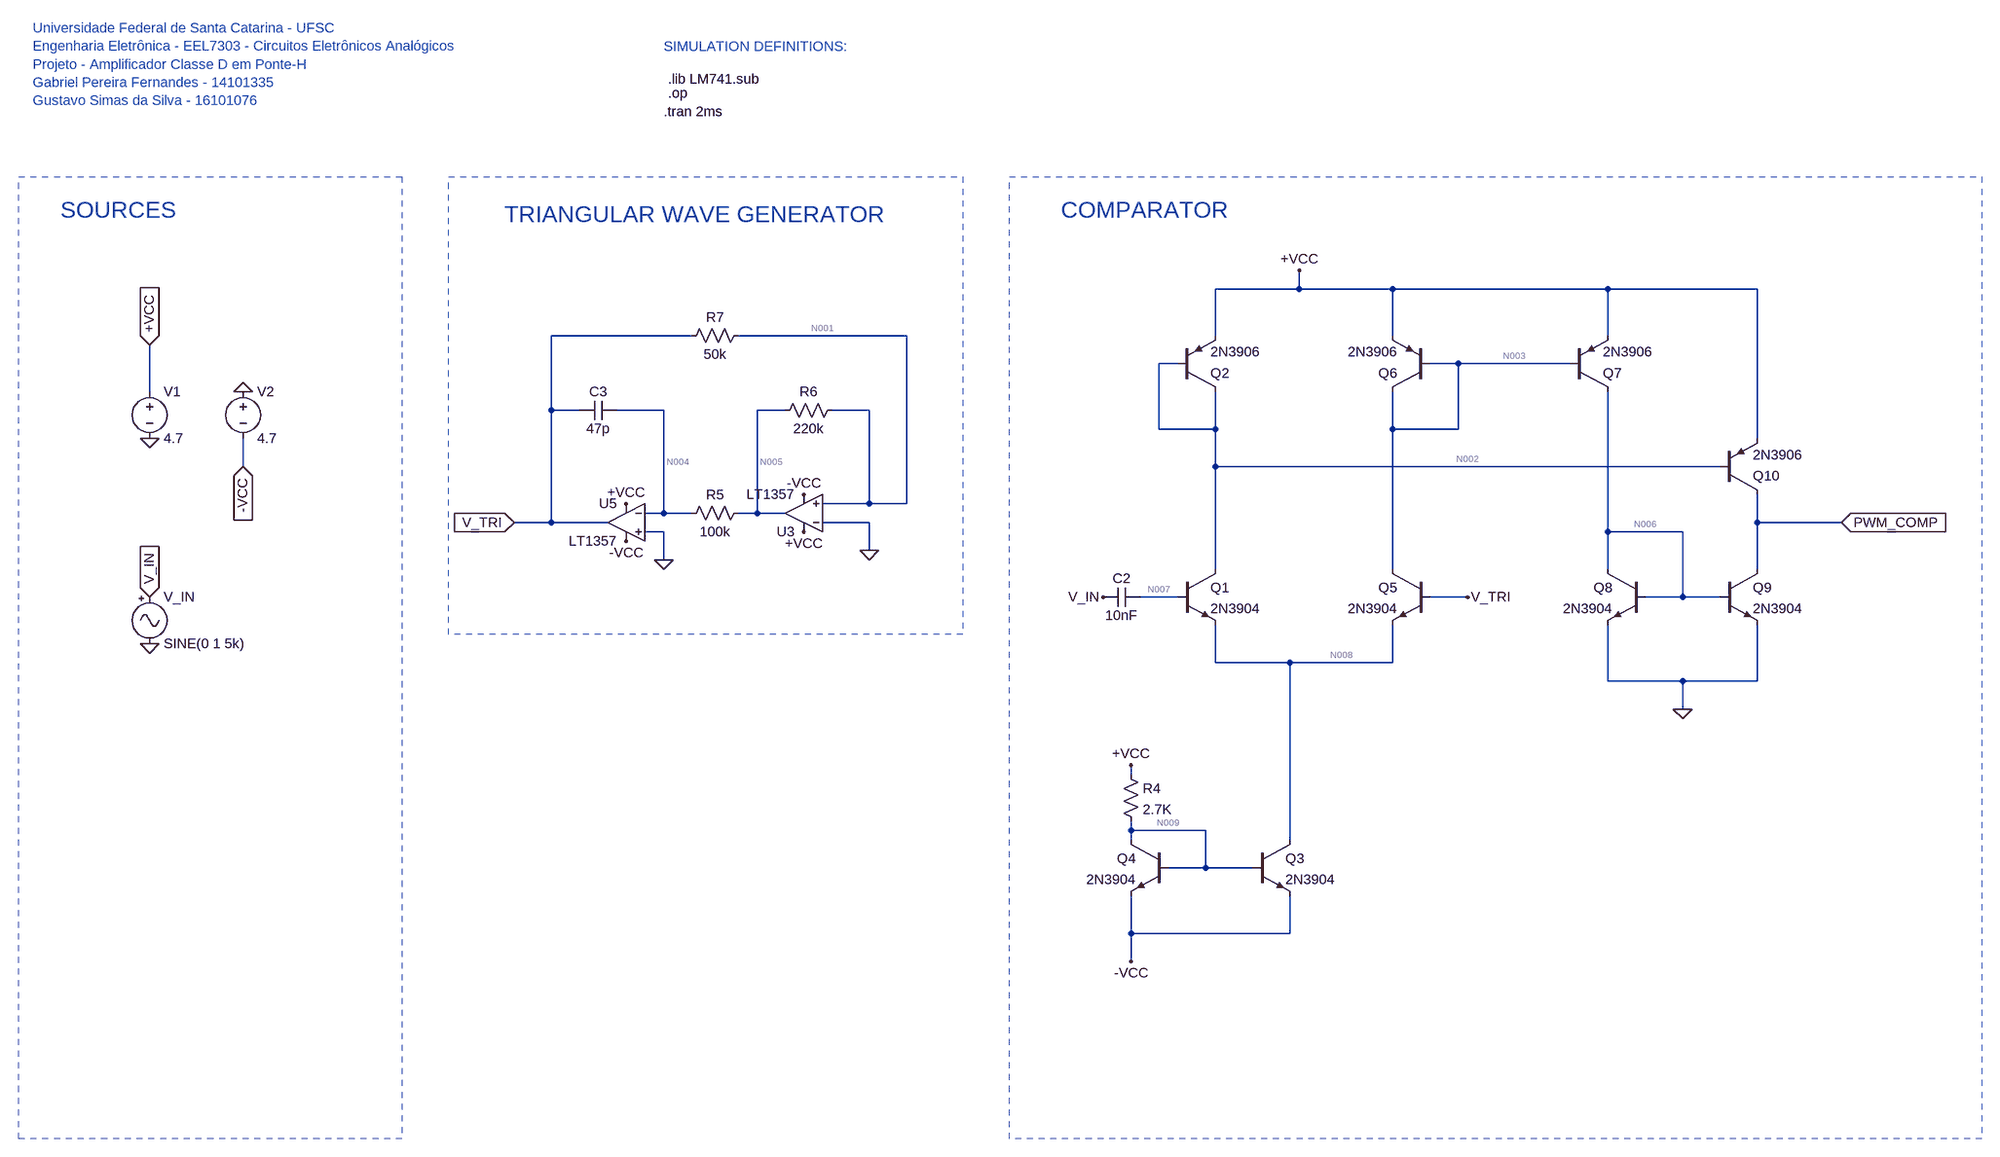
[diagram p0: schematic AmplificadorClasseD-V1.asc]
AmplificadorClasseD-V1.asc, the LTspice schematic file:
Version 4
SHEET 1 2448 932
WIRE 768 -528 768 -560
WIRE 768 -528 624 -528
WIRE 928 -528 768 -528
WIRE 1296 -528 928 -528
WIRE 1552 -528 1296 -528
WIRE -272 -448 -512 -448
WIRE 96 -448 -192 -448
WIRE 624 -448 624 -528
WIRE 928 -448 928 -528
WIRE 1296 -448 1296 -528
WIRE 560 -400 528 -400
WIRE 1040 -400 992 -400
WIRE 1232 -400 1040 -400
WIRE -1200 -352 -1200 -432
WIRE -512 -320 -512 -448
WIRE -464 -320 -512 -320
WIRE -320 -320 -400 -320
WIRE -112 -320 -160 -320
WIRE 32 -320 -32 -320
WIRE 528 -288 528 -400
WIRE 624 -288 624 -352
WIRE 624 -288 528 -288
WIRE 928 -288 928 -352
WIRE 1040 -288 1040 -400
WIRE 1040 -288 928 -288
WIRE 1552 -272 1552 -528
WIRE -1040 -224 -1040 -272
WIRE 624 -224 624 -288
WIRE 1488 -224 624 -224
WIRE 32 -160 32 -320
WIRE 32 -160 -48 -160
WIRE 96 -160 96 -448
WIRE 96 -160 32 -160
WIRE -320 -144 -320 -320
WIRE -320 -144 -352 -144
WIRE -272 -144 -320 -144
WIRE -160 -144 -160 -320
WIRE -160 -144 -192 -144
WIRE -112 -144 -160 -144
WIRE -512 -128 -512 -320
WIRE -512 -128 -576 -128
WIRE -416 -128 -512 -128
WIRE 32 -128 -48 -128
WIRE 1552 -128 1552 -176
WIRE 1696 -128 1552 -128
WIRE -320 -112 -352 -112
WIRE 1296 -112 1296 -352
WIRE 1424 -112 1296 -112
WIRE 32 -80 32 -128
WIRE -320 -64 -320 -112
WIRE 624 -48 624 -224
WIRE 928 -48 928 -288
WIRE 1296 -48 1296 -112
WIRE 1552 -48 1552 -128
WIRE 560 0 496 0
WIRE 1056 0 992 0
WIRE 1424 0 1424 -112
WIRE 1424 0 1360 0
WIRE 1488 0 1424 0
WIRE 624 112 624 48
WIRE 752 112 624 112
WIRE 928 112 928 48
WIRE 928 112 752 112
WIRE 1296 144 1296 48
WIRE 1424 144 1296 144
WIRE 1552 144 1552 48
WIRE 1552 144 1424 144
WIRE 1424 192 1424 144
WIRE 480 304 480 288
WIRE 480 400 480 384
WIRE 608 400 480 400
WIRE 480 416 480 400
WIRE 752 416 752 112
WIRE 608 464 608 400
WIRE 608 464 544 464
WIRE 688 464 608 464
WIRE 480 576 480 512
WIRE 752 576 752 512
WIRE 752 576 480 576
WIRE 480 624 480 576
FLAG -1200 -272 0
FLAG -1200 -432 +VCC
IOPIN -1200 -432 In
FLAG -1040 -352 0
FLAG -1040 -224 -VCC
IOPIN -1040 -224 In
FLAG -1200 80 0
FLAG -1200 0 V_IN
IOPIN -1200 0 In
FLAG 480 288 +VCC
FLAG 480 624 -VCC
FLAG 432 0 V_IN
FLAG 1056 0 V_TRI
FLAG 768 -560 +VCC
FLAG 1424 192 0
FLAG 1696 -128 PWM_COMP
IOPIN 1696 -128 In
FLAG -384 -160 +VCC
FLAG -384 -96 -VCC
FLAG -320 -64 0
FLAG -80 -112 +VCC
FLAG -80 -176 -VCC
FLAG 32 -80 0
FLAG -576 -128 V_TRI
IOPIN -576 -128 In
SYMBOL voltage -1200 -368 R0
WINDOW 123 0 0 Left 0
WINDOW 39 0 0 Left 0
SYMATTR InstName V1
SYMATTR Value 4.7
SYMBOL voltage -1040 -368 R0
WINDOW 123 0 0 Left 0
WINDOW 39 0 0 Left 0
SYMATTR InstName V2
SYMATTR Value 4.7
SYMBOL npn 560 -48 R0
SYMATTR InstName Q1
SYMATTR Value 2N3904
SYMBOL pnp 560 -352 M180
SYMATTR InstName Q2
SYMATTR Value 2N3906
SYMBOL Misc\\signal -1200 -16 R0
WINDOW 123 0 0 Left 0
WINDOW 39 0 0 Left 0
SYMATTR InstName V_IN
SYMATTR Value SINE(0 1 5k)
SYMBOL npn 688 416 R0
SYMATTR InstName Q3
SYMATTR Value 2N3904
SYMBOL npn 544 416 M0
SYMATTR InstName Q4
SYMATTR Value 2N3904
SYMBOL res 464 288 R0
SYMATTR InstName R4
SYMATTR Value 2.7K
SYMBOL npn 992 -48 M0
SYMATTR InstName Q5
SYMATTR Value 2N3904
SYMBOL pnp 992 -352 R180
SYMATTR InstName Q6
SYMATTR Value 2N3906
SYMBOL cap 496 -16 R90
WINDOW 0 0 32 VBottom 2
WINDOW 3 32 32 VTop 2
SYMATTR InstName C2
SYMATTR Value 10nF
SYMBOL pnp 1232 -352 M180
SYMATTR InstName Q7
SYMATTR Value 2N3906
SYMBOL npn 1360 -48 M0
SYMATTR InstName Q8
SYMATTR Value 2N3904
SYMBOL npn 1488 -48 R0
SYMATTR InstName Q9
SYMATTR Value 2N3904
SYMBOL pnp 1488 -176 M180
SYMATTR InstName Q10
SYMATTR Value 2N3906
SYMBOL Opamps\\LT1357 -384 -192 M0
SYMATTR InstName U5
SYMBOL res -176 -160 R90
WINDOW 0 0 56 VBottom 2
WINDOW 3 32 56 VTop 2
SYMATTR InstName R5
SYMATTR Value 100k
SYMBOL Opamps\\LT1357 -80 -80 R180
SYMATTR InstName U3
SYMBOL cap -400 -336 R90
WINDOW 0 0 32 VBottom 2
WINDOW 3 32 32 VTop 2
SYMATTR InstName C3
SYMATTR Value 47p
SYMBOL res -16 -336 R90
WINDOW 0 0 56 VBottom 2
WINDOW 3 32 56 VTop 2
SYMATTR InstName R6
SYMATTR Value 220k
SYMBOL res -176 -464 R90
WINDOW 0 0 56 VBottom 2
WINDOW 3 32 56 VTop 2
SYMATTR InstName R7
SYMATTR Value 50k
TEXT -320 -960 Left 2 !.tran 2ms
TEXT -312 -1016 Left 2 !.lib LM741.sub
TEXT -1400 -1104 Left 2 ;Universidade Federal de Santa Catarina - UFSC\nEngenharia Eletrônica - EEL7303 - Circuitos Eletrônicos Analógicos\nProjeto - Amplificador Classe D em Ponte-H\nGabriel Pereira Fernandes - 14101335\nGustavo Simas da Silva - 16101076
TEXT -320 -1072 Left 2 ;SIMULATION DEFINITIONS:
TEXT -312 -992 Left 2 !.op
TEXT -1352 -664 Left 4 ;SOURCES
TEXT -592 -656 Left 4 ;TRIANGULAR WAVE GENERATOR
TEXT 360 -664 Left 4 ;COMPARATOR
RECTANGLE Normal -768 928 -1424 -720 2
RECTANGLE Normal 192 64 -688 -720 2
RECTANGLE Normal 1936 928 272 -720 2

The netlist it stands for:
* AmplificadorClasseD-V1.asc
V1 +VCC 0 4.7
V2 0 -VCC 4.7
Q1 N002 N007 N008 0 2N3904
Q2 N002 N002 +VCC 0 2N3906
V_IN V_IN 0 SINE(0 1 5k)
Q3 N008 N009 -VCC 0 2N3904
Q4 N009 N009 -VCC 0 2N3904
R4 +VCC N009 2.7K
Q5 N003 V_TRI N008 0 2N3904
Q6 N003 N003 +VCC 0 2N3906
C2 N007 V_IN 10nF
Q7 N006 N003 +VCC 0 2N3906
Q8 N006 N006 0 0 2N3904
Q9 PWM_COMP N006 0 0 2N3904
Q10 PWM_COMP N002 +VCC 0 2N3906
XU5 0 N004 +VCC -VCC V_TRI LT1357  ; pins In+ In- V+ V- OUT
R5 N005 N004 100k
XU3 N001 0 +VCC -VCC N005 LT1357  ; pins In+ In- V+ V- OUT
C3 N004 V_TRI 47p
R6 N001 N005 220k
R7 N001 V_TRI 50k
.model NPN NPN
.model PNP PNP
.lib standard.bjt
.tran 2ms
.lib LM741.sub
* Universidade Federal de Santa Catarina - UFSC
* Engenharia Eletrônica - EEL7303 - Circuitos Eletrônicos Analógicos
* Projeto - Amplificador Classe D em Ponte-H
* Gabriel Pereira Fernandes - 14101335
* Gustavo Simas da Silva - 16101076
* SIMULATION DEFINITIONS:
.op
* SOURCES
* TRIANGULAR WAVE GENERATOR
* COMPARATOR
.backanno
.end

* Results of the author's LTspice run, read from the files saved beside the schematic
* Operating Point, zero values left out:
*   V(+vcc) = 4.7 V
*   V(-vcc) = -4.7 V
*   V(n002) = 4.393 V
*   V(n007) = -377 mV
*   V(n008) = -682.4 mV
*   V(n009) = -4.014 V
*   V(n003) = 4.013 V
*   V(v_tri) = 3.289 mV
*   V(n006) = 683.6 mV
*   V(pwm_comp) = 5.878 mV
*   V(n004) = -55.21 nV
*   V(n005) = 12.06 mV
*   V(n001) = 181.5 nV
*   Ic(Q10) = -1.465 nA
*   Ib(Q10) = -2.911 pA
*   Ie(Q10) = 1.468 nA
*   Ic(Q7) = -3.375 mA
*   Ib(Q7) = -16.47 µA
*   Ie(Q7) = 3.392 mA
*   Ic(Q6) = -3.268 mA
*   Ib(Q6) = -16.47 µA
*   Ie(Q6) = 3.284 mA
*   Ic(Q2) = -1.399 nA
*   Ib(Q2) = -7.301 pA
*   Ie(Q2) = 1.406 nA
*   Ic(Q9) = 1.465 nA
*   Ib(Q9) = 435.1 µA
*   Ie(Q9) = -435.1 µA
*   Ic(Q8) = 2.93 mA
*   Ib(Q8) = 9.839 µA
*   Ie(Q8) = -2.94 mA
*   Ic(Q5) = 3.301 mA
*   Ib(Q5) = 10.66 µA
*   Ie(Q5) = -3.311 mA
*   Ic(Q4) = 3.206 mA
*   Ib(Q4) = 10.77 µA
*   Ie(Q4) = -3.217 mA
*   Ic(Q3) = 3.311 mA
*   Ib(Q3) = 10.77 µA
*   Ie(Q3) = -3.322 mA
*   Ic(Q1) = 1.409 nA
*   Ie(Q1) = -1.409 nA
*   I(R7) = -65.79 nA
*   I(R6) = -54.82 nA
*   I(R5) = 120.6 nA
*   I(R4) = 3.227 mA
*   I(V2) = -9.899 mA
*   I(V1) = -13.27 mA
*   Ix(u5:1) = 120.6 nA
*   Ix(u5:2) = 120.6 nA
*   Ix(u5:3) = 1.688 mA
*   Ix(u5:4) = -1.678 mA
*   Ix(u5:5) = -10.73 µA
*   Ix(u3:1) = 120.6 nA
*   Ix(u3:2) = 120.6 nA
*   Ix(u3:3) = 1.683 mA
*   Ix(u3:4) = -1.683 mA
*   Ix(u3:5) = -175.4 nA